# Altium schematic sheet USB and LEDs.SchDoc
size A; Engineer: Will Snyder; Revision: 1.0; SheetNumber: 2; SheetTotal: 2; DocumentTitle: USB Type-C and LEDs
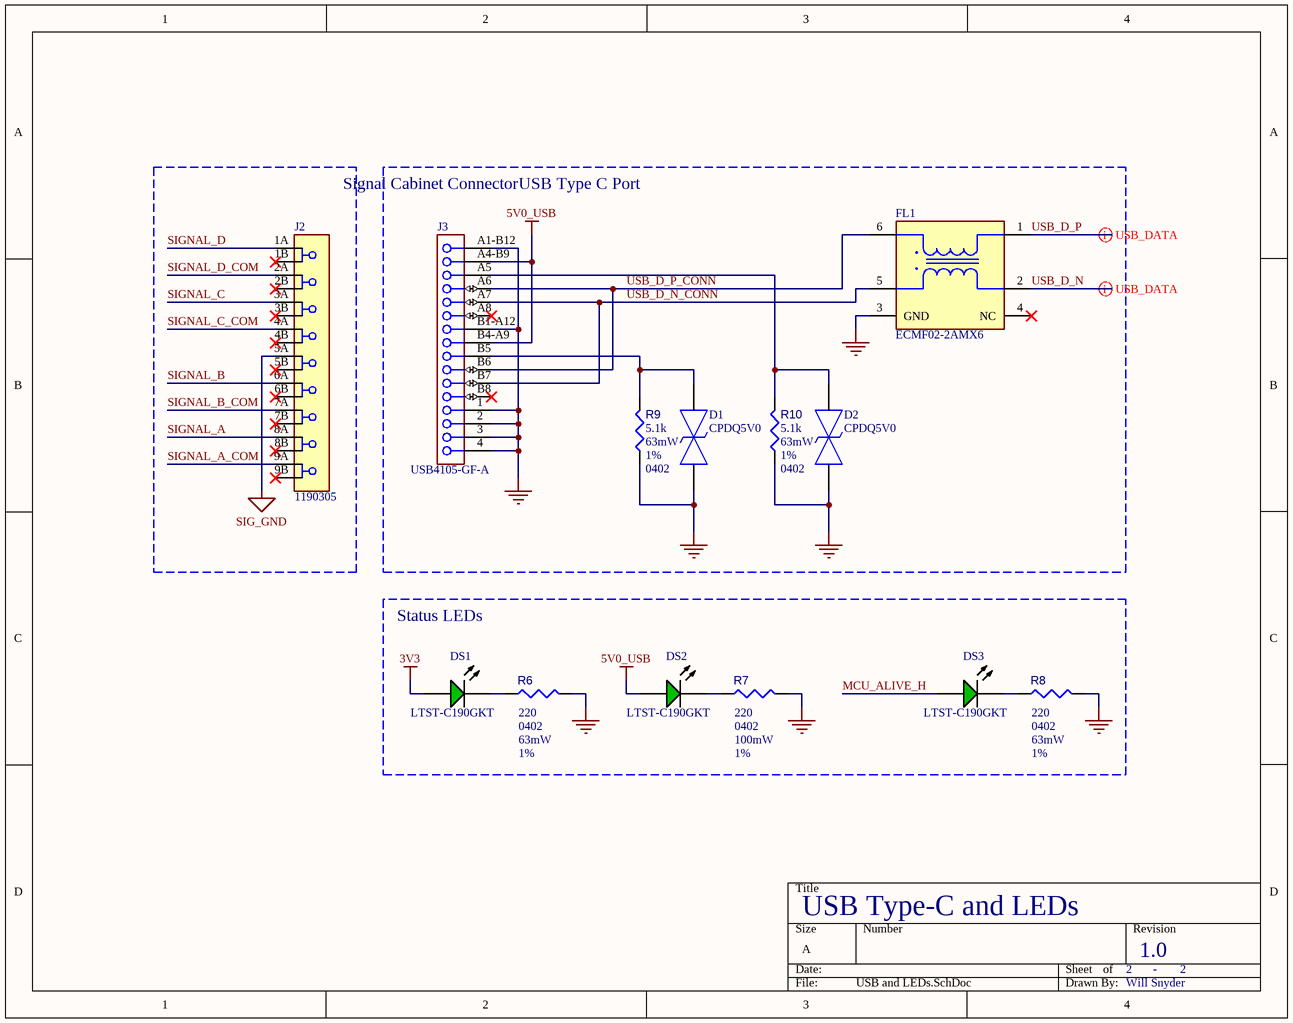
[diagram p0: USB and LEDs.SchDoc]

## Parts
D1  CPDQ5V0  [MBTB-D-SOD-923F-IMP-0402]
D2  CPDQ5V0  [MBTB-D-SOD-923F-IMP-0402]
DS1  LTST-C190GKT  [LTST-C190GKT_V]
DS2  LTST-C190GKT  [LTST-C190GKT_V]
DS3  LTST-C190GKT  [LTST-C190GKT_V]
FL1  ECMF02-2AMX6  [FP-QFN-6L-IPC_A]
J2  1190305  [PHOENIX_1190305]
J3  USB4105-GF-A  [FP-USB4105-GF-A-MFG]
R6  value 220  Tolerance: 1%  Power: 63mW  Case/Package: 0402  [RESC1005X40X25NL05T05]  (hidden comment: CRCW040259R0FKED)
R7  value 220  Case/Package: 0402  Tolerance: 1%  Power: 100mW  [RESC1005X40X25NL05T05]  (hidden comment: ERJ-2RKF1430X)
R8  value 220  Tolerance: 1%  Power: 63mW  Case/Package: 0402  [RESC1005X40X25NL05T05]  (hidden comment: CRCW040259R0FKED)
R9  value 5.1k  Power: 63mW  Tolerance: 1%  Case/Package: 0402  [RESC1005X40X25NL05T05]  (hidden comment: MCS04020C5101FE000)
R10  value 5.1k  Power: 63mW  Tolerance: 1%  Case/Package: 0402  [RESC1005X40X25NL05T05]  (hidden comment: MCS04020C5101FE000)

## Blocks framed on the sheet
Signal Cabinet Connector: J2
USB Type C Port: D1 D2 FL1 J3 R9 R10
Status LEDs: DS1-DS3 R6-R8

## Nets
3V3: DS1.1(A)
5V0_USB: DS2.1(A) J3.A4-B9(VBUS) J3.B4-A9(VBUS)
GND: D1.2(A) D2.2(A) FL1.3(GND) J3.1(MNT_1) J3.2(MNT_2) J3.3(MNT_3) J3.4(MNT_4) J3.A1-B12(GND) J3.B1-A12(GND) R6.2 R7.2 R8.2 R9.2 R10.2
SIG_GND: J2.5A
MCU_ALIVE_H: DS3.1(A)
SIGNAL_A: J2.8A
SIGNAL_A_COM: J2.9A
SIGNAL_B: J2.6A
SIGNAL_B_COM: J2.7A
SIGNAL_C: J2.3A
SIGNAL_C_COM: J2.4A
SIGNAL_D: J2.1A
SIGNAL_D_COM: J2.2A
USB_D_N: FL1.2(D-)
USB_D_N_CONN: FL1.5(D-) J3.A7(Dn1) J3.B7(Dn2)
USB_D_P: FL1.1(D+)
USB_D_P_CONN: FL1.6(D+) J3.A6(Dp1) J3.B6(Dp2)
NetD1_1: D1.1(K) J3.B5(CC2) R9.1
NetD2_1: D2.1(K) J3.A5(CC1) R10.1
NetDS1_2: DS1.2(K) R6.1
NetDS2_2: DS2.2(K) R7.1
NetDS3_2: DS3.2(K) R8.1

Not connected (* = marked no-connect by the designer): FL1 4(NC)*; J2 1B* 2B* 3B* 4B* 5B* 6B* 7B* 8B* 9B*; J3 A8(SBU1)* B8(SBU2)*

## Layout directives
differential pair: USB_D_N, USB_D_P

## Notes on the sheet
- -

## Library data of the parts
D1 D2 = CMP-004-00042-2: 18.6V Clamp 9.4A (8/20Âµs) Ipp Tvs Diode Surface Mount 0402/SOD-923F; MF: Comchip Technology; Design Item ID: CPDQ5V0-HF; SnapEDA_Link: https://www.snapeda.com/parts/CPDQ5V0-HF/Comchip%20Technology/view-part/809934/?ref=snap; Component Type: Standard; Purchase-URL: https://pricing.snapeda.com/search/part/CPDQ5V0-HF/?ref=eda; Pins: 2; Availability: Good; Source: CPDQ5V0-HF.SchLib; Case/Package: 0402 Comchip; Price: None; MP: CPDQ5V0-HF; Check_prices: https://www.snapeda.com/parts/CPDQ5V0-HF/Comchip%20Technology/view-part/809934/?ref=eda; Value: *
DS1-DS3 = CMP-007-00022-2: LED Uni-Color Green, 100 mW, 30 mA, -55 to 85 degC, 2-Pin SMD, RoHS, Tape and Reel; Manufacturer: Lite-On; Power: 100mW; Forward Voltage: 2.1V; Viewing Angle: 130degrees; Forward Current: 20mA; Luminous Intensity: 6mcd; Lens Style: Clear; Manufacturer URL: http://www.us.liteon.com/; RoHS Compliant: True; Colour: Green; Package Description: 2-Pin Surface Mount Device, Body 1.6 x 0.8 mm; Datasheet URL: http://datasheet.octopart.com/LTST-C190GKT-Lite-On-datasheet-158530.pdf; Datasheet Version: Dec-06; Mounting Technology: SM; Case/Package: 0603; Package Reference: C190GKT; Packaging: TapeandReel; Min Operating Temperature: -55°C; Nominal Vf: 2.1V; Package Quantity: 3000; Illumination Colour: Green; Max Operating Temperature: 85°C; Pins: 2
FL1 = CMP-00030-00005-1: Data Line Filter, 2 Function(s), 6 Pin(s), Plastic; Mounting Technology: Surface Mount; RoHS Compliant: Yes; Pins: 6; Min Operating Temperature: -40°C; Max Operating Temperature: 85°C
J2 = CMP-106-000000-2: LPT 2,5/ 9-5,0; MF: Phoenix Contact; Source: 1190305.SchLib; Pin Count: 18; Value: *; SnapEDA_Link: https://www.snapeda.com/parts/1190305/Phoenix+Contact/view-part/?ref=snap; Package: None; MP: 1190305; Design Item ID: 1190305; Check_prices: https://www.snapeda.com/parts/1190305/Phoenix+Contact/view-part/?ref=eda; Component Type: Standard
J3 = CMP-002-00095-3: Conn USB 2.0 Type C RCP 24 POS 0.3mm/0.5mm Solder RA SMD 24 Terminal 1 Port T/R
R6 R8 = CMP-009-00207-1: Fixed Resistor, Metal Glaze/thick Film, 0.063W, 59ohm, 50V, 1% +/-Tol, 100ppm/Cel, Surface Mount, 0402; Mounting Technology: Surface Mount; Max Operating Temperature: 155°C; RoHS Compliant: Yes; Min Operating Temperature: -55°C; Pins: 2
R7 = CMP-009-00208-1: Fixed Resistor, Metal Glaze/thick Film, 0.1W, 143ohm, 50V, 1% +/-Tol, 100ppm/Cel, Surface Mount, 0402; Mounting Technology: Surface Mount; RoHS Compliant: Yes; Min Operating Temperature: -55°C; Pins: 2; Max Operating Temperature: 155°C
R9 R10 = CMP-009-00205-1: Fixed Resistor, Thin Film, 0.063W, 5100ohm, 50V, 1% +/-Tol, 50ppm/Cel, Surface Mount, 0402; Min Operating Temperature: -55°C; Pins: 2; Max Operating Temperature: 125°C; Mounting Technology: Surface Mount; RoHS Compliant: Yes